# Altium schematic sheet PIN_bias_voltage.SchDoc
size A3; Organization: Altium Limited; Address1: L3, 12a Rodborough Rd; Address2: Frenchs Forest; Address3: NSW; Address4: Australia 2086; DocumentNumber: 3; SheetNumber: 3; SheetTotal: 19
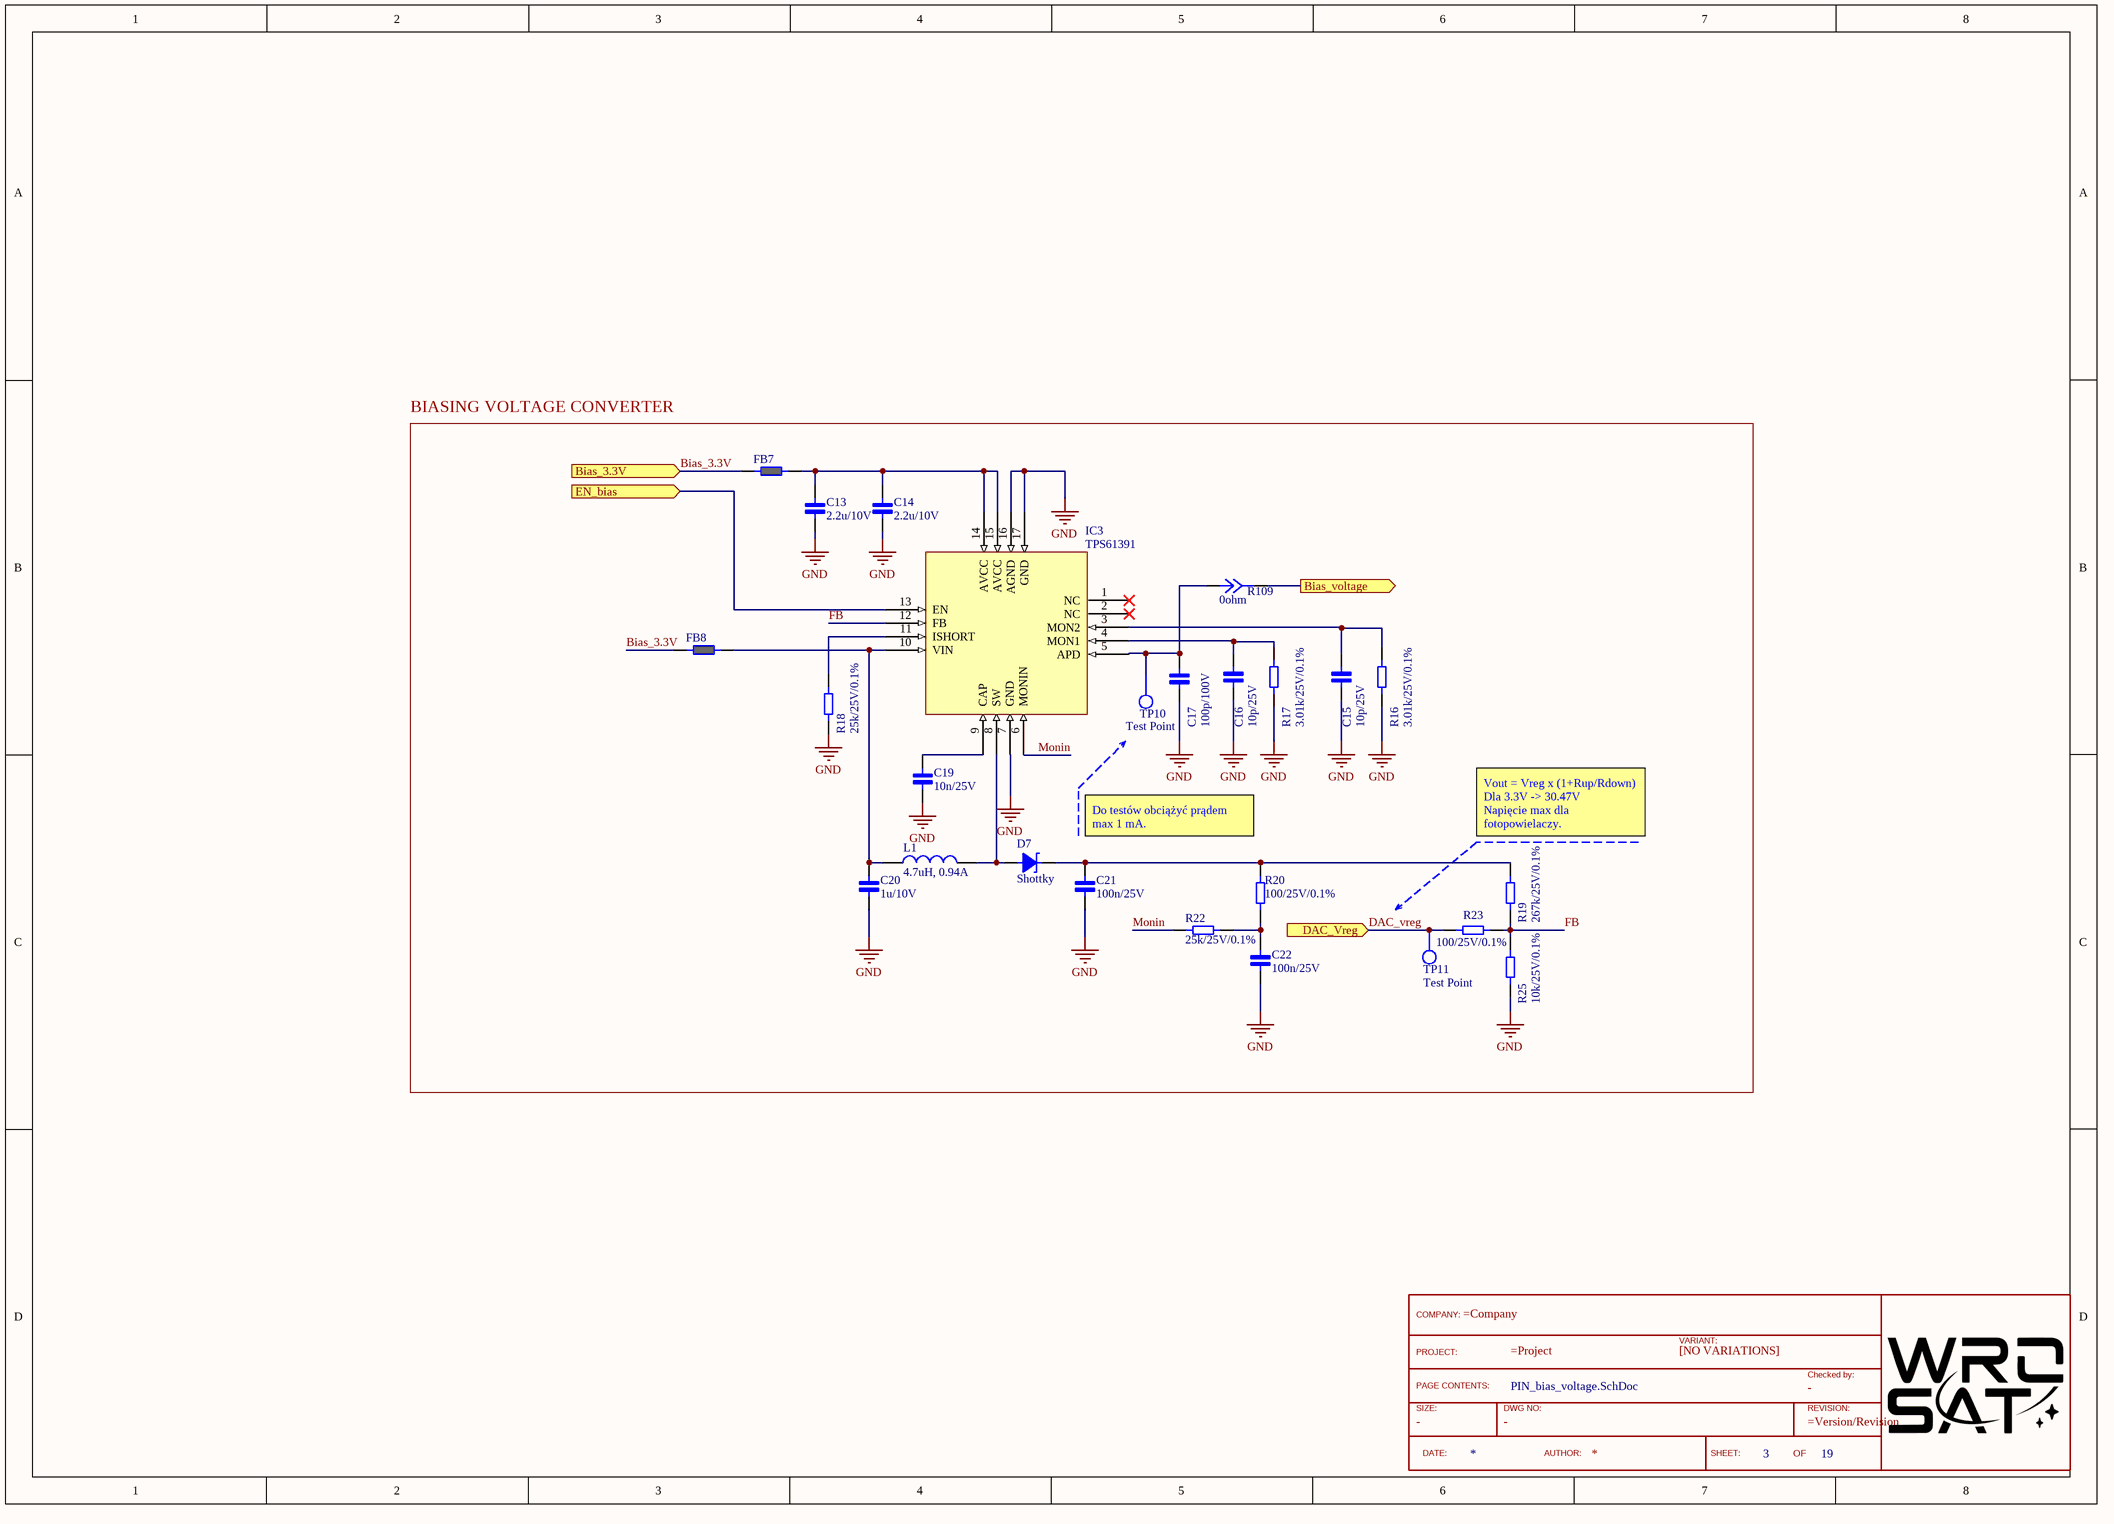
[diagram p0: PIN_bias_voltage.SchDoc]

## Parts
?  TitleBlock  (value not drawn)  (graphical)
C13  2.2u/10V  [Cap_0402]
C14  2.2u/10V  [Cap_0402]
C15  10p/25V  [Cap_0402]
C16  10p/25V  [Cap_0402]
C17  100p/100V  [Cap_0402]
C19  10n/25V  [Cap_0402]
C20  1u/10V  [Cap_0402]
C21  100n/25V  [Cap_0402]
C22  100n/25V  [Cap_0402]
D7  Shottky  [SOD323]
FB7  Ferrite_bead_0402  [FERRITE_0402]  (value not drawn)
FB8  Ferrite_bead_0402  [FERRITE_0402]  (value not drawn)
IC3  TPS61391  [WQFN16]
L1  4.7uH, 0.94A  [WE-MAPI_2510]
R16  3.01k/25V/0.1%  [RES_0402]
R17  3.01k/25V/0.1%  [RES_0402]
R18  25k/25V/0.1%  [RES_0402]
R19  267k/25V/0.1%  [RES_0402]
R20  100/25V/0.1%  [RES_0402]
R22  25k/25V/0.1%  [RES_0402]
R23  100/25V/0.1%  [RES_0402]
R25  10k/25V/0.1%  [RES_0402]
R109  0ohm  [Jumper 2]
TP10  Test Point  [Test Point SMT]
TP11  Test Point  [Test Point SMT]

## Blocks framed on the sheet
BIASING VOLTAGE CONVERTER: C13-C17 C19-C22 D7 FB7 FB8 IC3 L1 R16-R20 R22 R23 R25 R109 TP10 TP11

## Ports
Bias_3.3V (in), Bias_voltage (out), DAC_Vreg (in), EN_bias (in)

## Nets
GND: C13.1 C14.1 C15.1 C16.1 C17.1 C19.1 C20.1 C21.1 C22.1 IC3.7(GND) IC3.16(AGND) IC3.17(GND) R16.1 R17.1 R18.1 R25.1
Bias_3.3V: FB7.1 FB8.1 ; port Bias_3.3V
Bias_voltage: R109.2 ; port Bias_voltage
DAC_vreg: R23.1 TP11.1 ; port DAC_Vreg
EN_bias: IC3.13(EN) ; port EN_bias
FB: IC3.12(FB) R19.1 R23.2 R25.2
Monin: IC3.6(MONIN) R22.1
NetC13_2: C13.2 C14.2 FB7.2 IC3.14(AVCC) IC3.15(AVCC)
NetC15_2: C15.2 IC3.3(MON2) R16.2
NetC16_2: C16.2 IC3.4(MON1) R17.2
NetC17_2: C17.2 IC3.5(APD) R109.1 TP10.1
NetC19_2: C19.2 IC3.9(CAP)
NetC20_2: C20.2 FB8.2 IC3.10(VIN) L1.1
NetC21_2: C21.2 D7.2 R19.2 R20.2
NetC22_2: C22.2 R20.1 R22.2
NetD7_1: D7.1 IC3.8(SW) L1.2
NetIC3_11: IC3.11(ISHORT) R18.2

Not connected (* = marked no-connect by the designer): IC3 1(NC)* 2(NC)*

## Notes on the sheet
- Do testów obciążyć prądem max 1 mA.
- (near R19) Vout = Vreg x (1+Rup/Rdown)
  Dla 3.3V -> 30.47V
  Napięcie max dla fotopowielaczy.
- Title
- Size:
- Date:
- A3
- Number:
- Time:
- Revision:
- Sheet
- of
- File:
- (in symbol TitleBlock) COMPANY:; VARIANT:; PROJECT:; [NO VARIATIONS]; PAGE CONTENTS:; Checked by:; SIZE:; DWG NO:; REVISION:; DATE:; AUTHOR:; SHEET:; OF

## Library data of the parts
? = TitleBlock: Standard TitleBlock; DrawingNo: -; Size: -; Checked: -
C13 C14 = Cap_0402_2.2u: Ceramic Capacitor 2.2uF / 0402 / 10V / ±5%, Wurth Elektronik MLCC
C15 C16 = Cap_0402_10p: 0402 / 25V / ±5%, Wurth Elektronik MLCC; ComponentLink1Description: New link; ComponentLink1URL: https://www.we-online.com/catalog/en/WCAP-CSGP-25VDC
C17 = Cap_0402_100p_hv: 0402 / 100V / ±5%, Wurth Elektronik MLCC; ComponentLink1Description: New link; ComponentLink1URL: https://www.we-online.com/catalog/en/WCAP-CSGP-25VDC
C19 = Cap_0402_10n: Ceramic Capacitor 10n / 0402 / 25V / ±5%, Wurth Elektronik MLCC; ComponentLink1Description: New link; ComponentLink1URL: https://www.we-online.com/catalog/en/WCAP-CSGP-25VDC
C20 = Cap_0402_1u: Ceramic Capacitor 1uF / 0402 / 10V / ±5%, Wurth Elektronik MLCC
C21 C22 = Cap_0402_100n: Ceramic Capacitor 100n / 0402 / 25V / ±5%, Wurth Elektronik MLCC; ComponentLink1Description: New link; ComponentLink1URL: https://www.we-online.com/catalog/en/WCAP-CSGP-25VDC
D7 = 1SS355VMFHTE-17: Schottky diode, 90V, 100mA, 1.2V, 4ns; ComponentLink1Description: New link; ComponentLink1URL: http://www.farnell.com/datasheets/2296360.pdf?_ga=2.82751826.559014072.1603739164-289843645.1554760282&_gac=1.61669086.1603127928.Cj0KCQjw8rT8BRCbARIsALWiOvSVwk9r5eslWLPnwyA40yS03dA_HOx56l5PpmQm_xU-UzALJc7kcHAaAvh7EALw_wcB
FB7 FB8 = Ferrite_bead_0402: Ferrite bead, wurth 74269241102
IC3 = TPS61391: TPS61391 85-VOUT Boost Converter with Current Mirror Integrated; ComponentLink1Description: New link; ComponentLink1URL: https://www.ti.com/lit/ds/symlink/tps61391.pdf
L1 = 74438323047: WE-MAPI SMT Power Inductor, size 2510, 4.7uH, 0.94A; Manufacturer: Wurth Elektronik; DC Resistance typ.: 338mOhm; DC Resistance max.: 388mOhm; Self Resonant Frequency: 35MHz; Saturation Current: 1.75A; ComponentLink1Description: Manufacturer; ComponentLink1URL: http://www.we-online.de; ComponentLink2Description: Datasheet; ComponentLink2URL: https://www.we-online.com/catalog/datasheet/74438323047.pdf; Mounting Technology: SMT; Operating Temperature: -40 to +125degC; Packaging: Tape and Reel; Published Date: April 2020; Size: 2510; Inductance: 4.7uH; Manufacturer Part Number: 74438323047; Rated Current: 0.94A
R16 R17 = Res_0402_3.01k: Vishay, thin film resistor 3.01k/25V/0.1%
R18 R22 = Res_0402_25k: Vishay, thin film resistor 25k/25V/0.1%
R19 = Res_0402_267k: Vishay, thin film resistor 267k/25V/0.1%
R20 R23 = Res_0402_100: Vishay, thin film resistor 100/25V/0.1%
R25 = Res_0402_10k: Vishay, thin film resistor 10k/25V/0.1%
R109 = Jumper